# EAGLE design proto (EAGLE 9.2.0)
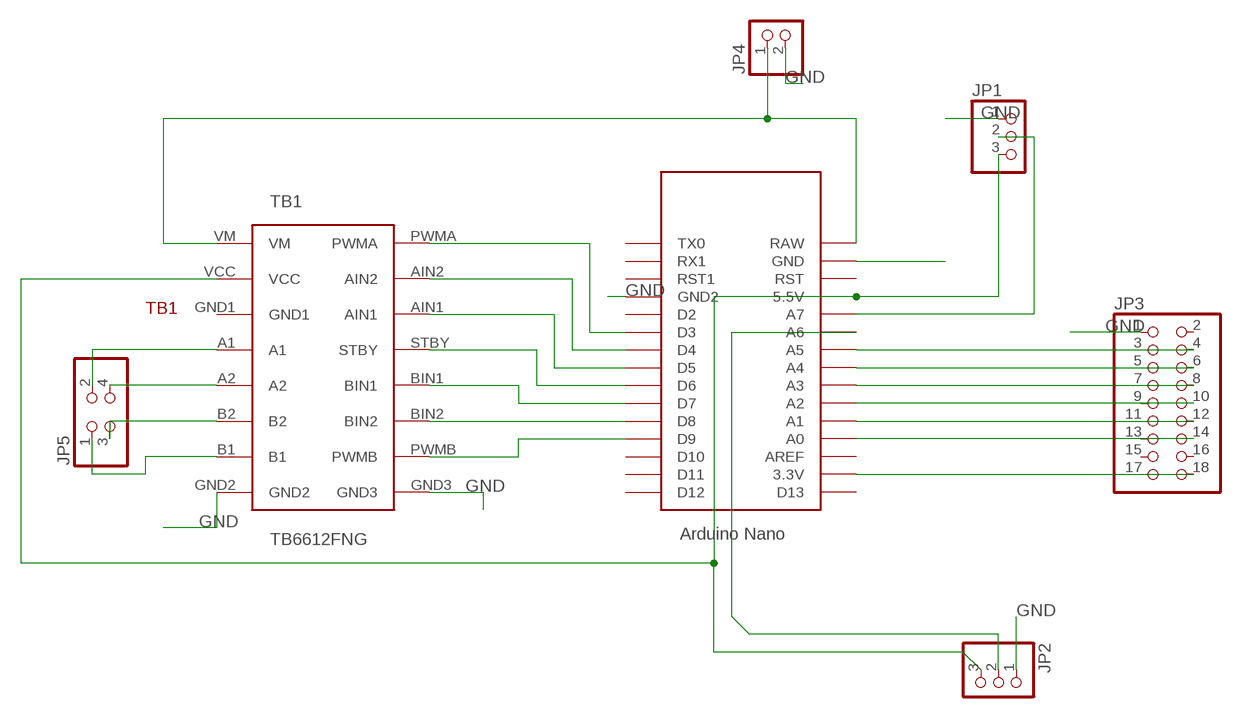
[diagram p0: schematic, sheet 1]

## Parts
JP1  PINHD-1X3  [1X03]
JP2  PINHD-1X3  [1X03]
JP3  PINHD-2X9  [2X09]
JP4  PINHD-1X2  [1X02]
JP5  PINHD-2X2  [2X02]
TB1  TB6612FNG  [TB6612FNG]
U$1  NANO  [NANO]

## Nets
GND: JP1.1 JP2.1 JP3.1 JP4.2 TB1.GND2 TB1.GND3 U$1.GND U$1.GND1(GND2)
N$1: TB1.PWMA U$1.D3
N$2: TB1.AIN2 U$1.D4
N$3: TB1.AIN1 U$1.D5
N$4: TB1.STBY U$1.D6
N$5: TB1.BIN1 U$1.D7
N$6: TB1.BIN2 U$1.D8
N$7: TB1.PWMB U$1.D9
N$8: JP5.2 TB1.A1
N$9: JP4.1 TB1.VM U$1.RAW
N$10: JP3.4 U$1.A5
N$11: JP5.4 TB1.A2
N$12: JP5.3 TB1.B2
N$13: JP5.1 TB1.B1
N$14: JP3.6 U$1.A4
N$15: JP3.8 U$1.A3
N$16: JP3.10 U$1.A2
N$17: JP1.2 U$1.A7
N$18: JP3.12 U$1.A1
N$19: JP3.14 U$1.A0
N$20: JP3.18 U$1.3.3V
N$26: JP2.2 U$1.A6
N$27: JP1.3 JP2.3 TB1.VCC U$1.5V(5.5V)
Unconnected: JP3.2 JP3.3 JP3.5 JP3.7 JP3.9 JP3.11 JP3.13 JP3.15 JP3.16 JP3.17 TB1.GND1 U$1.AREF U$1.D2 U$1.D10 U$1.D11 U$1.D12 U$1.D13 U$1.ICSP1 U$1.ICSP2 U$1.ICSP3 U$1.ICSP4 U$1.ICSP5 U$1.ICSP6 U$1.RST U$1.RST1 U$1.RX1 U$1.TX0

## Library data of the parts
JP1 JP2 = pinhead:PINHD-1X3: PIN HEADER
JP3 = pinhead:PINHD-2X9: PIN HEADER
JP4 = pinhead:PINHD-1X2: PIN HEADER
JP5 = pinhead:PINHD-2X2: PIN HEADER
TB1 = TB6612FNG:TB6612FNG
U$1 = Arduino-clone:NANO: Arduino Nano

## Board
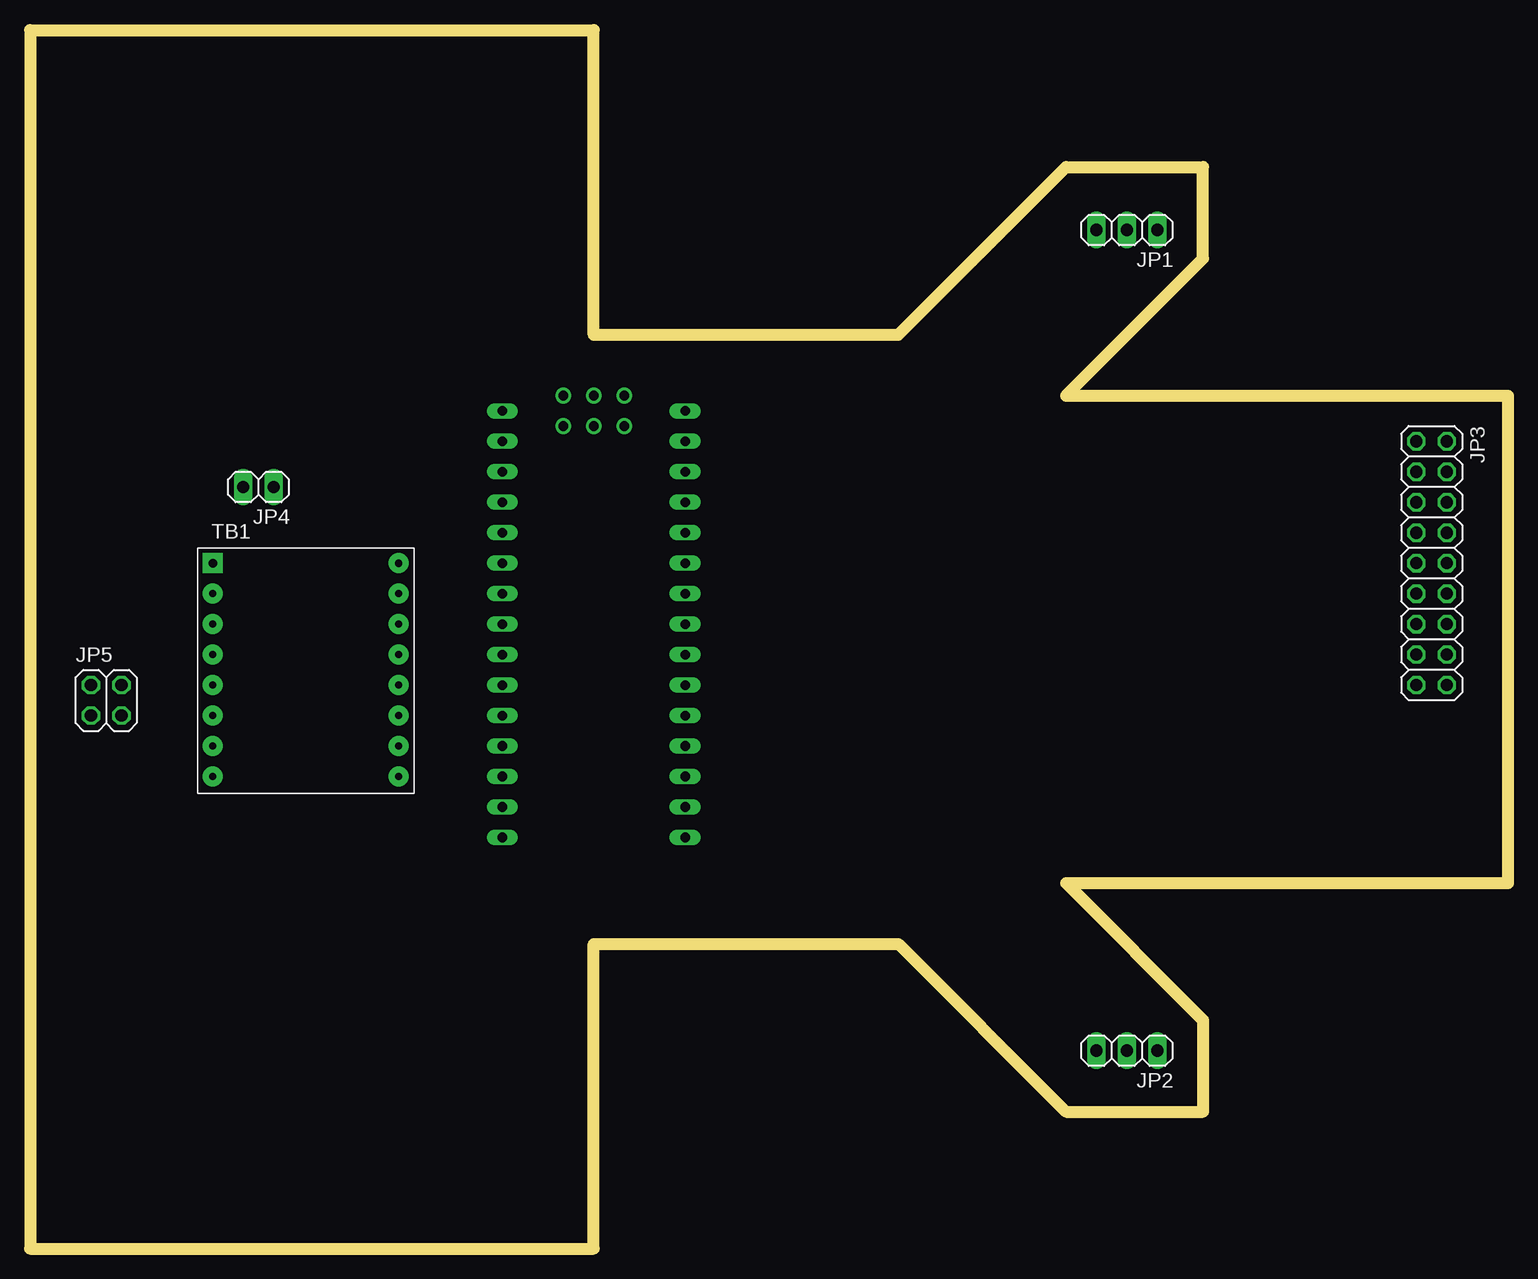
[diagram p1: board, top side]
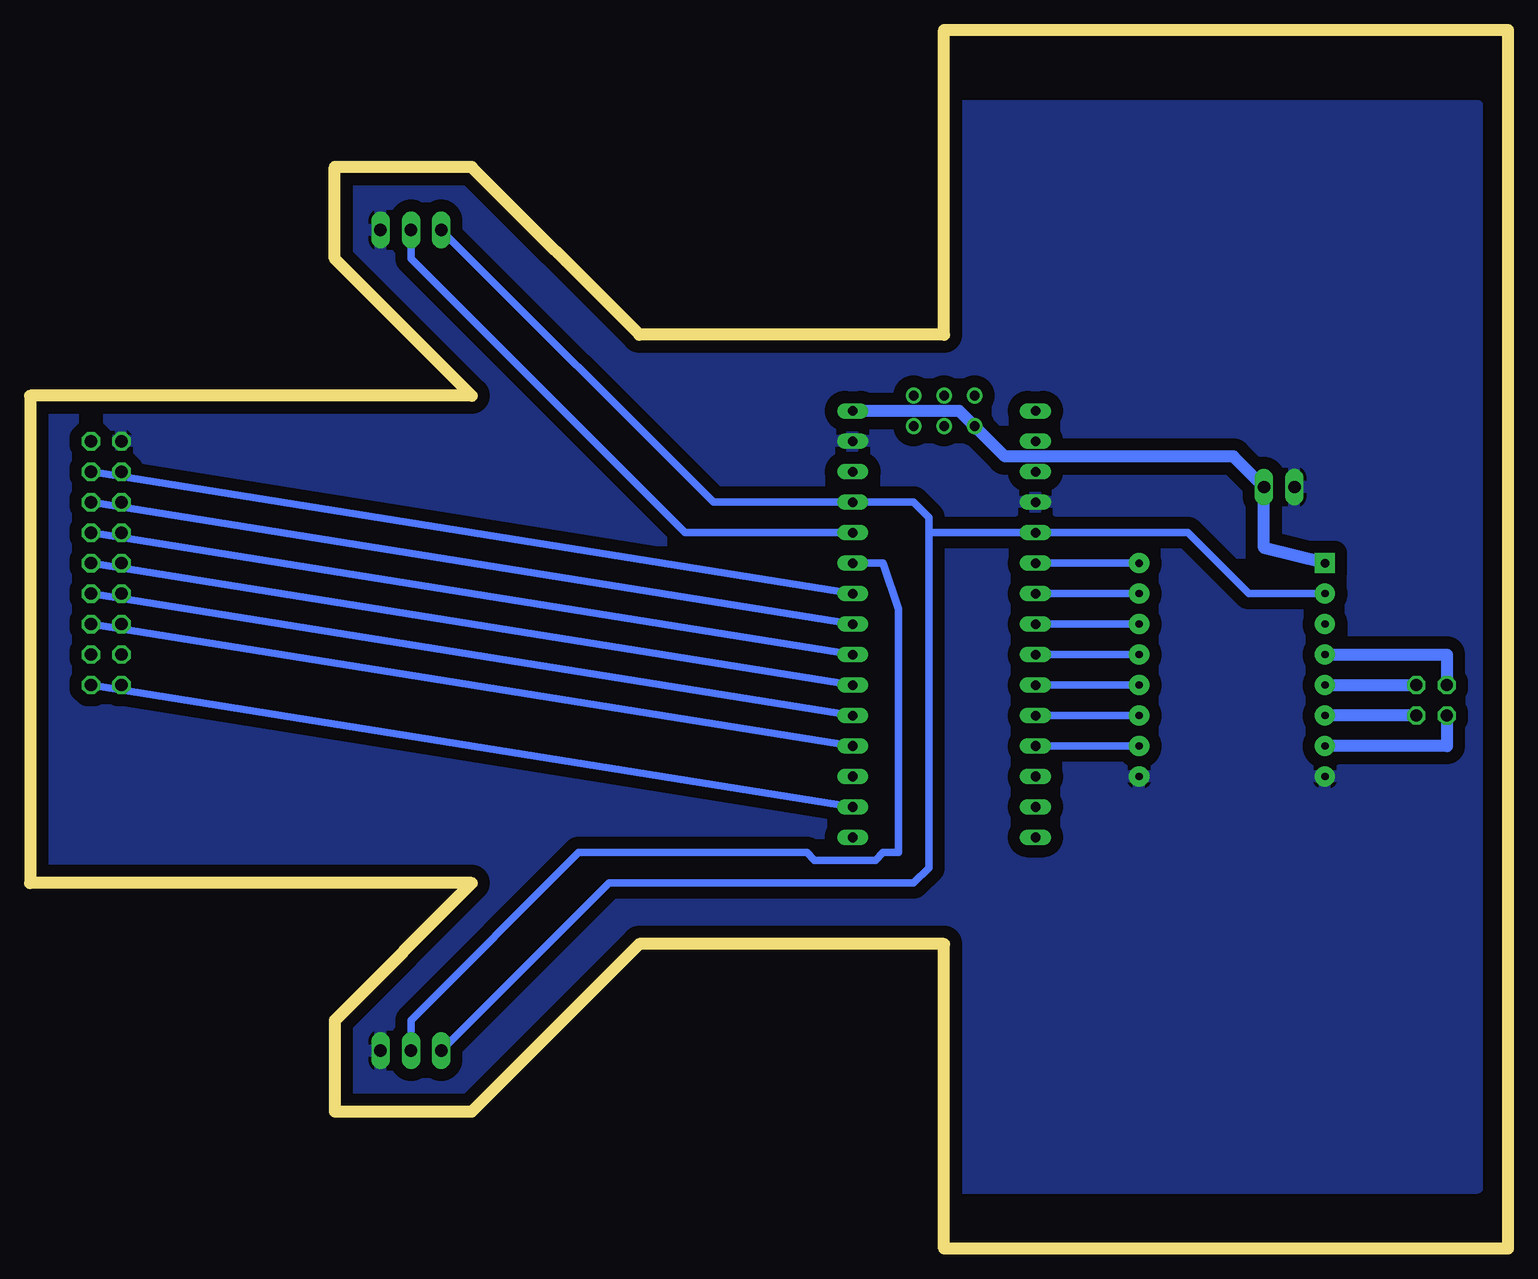
[diagram p2: board, bottom side, seen from below]

Size 123.19 x 101.6 mm. Coordinates in mm from the lower left corner, seen from the top.
Outline: 0,101.6 0,0 46.99,0 46.99,25.4 72.39,25.4 86.36,11.43 97.79,11.43 97.79,19.05 86.36,30.48 123.19,30.48 123.19,71.12 86.36,71.12 97.79,82.55 97.79,90.17 86.36,90.17 72.39,76.2 46.99,76.2 46.99,101.6 0,101.6
Copper layers (1*16): Top 0.035mm / dielectric 1.5mm / Bottom 0.035mm
Design rules "default *": minimum track width 6mil, minimum drill 0.8mm, track to track 6mil, track to pad 6mil, pad to pad 6mil, via to via 6mil, smd to smd 6mil, copper to edge 40mil, drill to drill 6mil, minimum pad ring 10mil, minimum via ring 8mil, stop-mask expansion 4mil, vias tented up to drill 0mil, thermal gap 10mil

### Footprints (pad centres in the part's own frame; a part is rotated, then mirrored left to right if it is on the bottom)
1X03 = drill 1.016 long: 1 -2.54,0; 2 0,0; 3 2.54,0
2X09 = drill 1.016 octagon: 1 -10.16,-1.27; 2 -10.16,1.27; 3 -7.62,-1.27; 4 -7.62,1.27; 5 -5.08,-1.27; 6 -5.08,1.27; 7 -2.54,-1.27; 8 -2.54,1.27; 9 0,-1.27; 10 0,1.27; 11 2.54,-1.27; 12 2.54,1.27; 13 5.08,-1.27; 14 5.08,1.27; 15 7.62,-1.27; 16 7.62,1.27; 17 10.16,-1.27; 18 10.16,1.27
1X02 = drill 1.016 long: 1 -1.27,0; 2 1.27,0
2X02 = drill 1.016 octagon: 1 -1.27,-1.27; 2 -1.27,1.27; 3 1.27,-1.27; 4 1.27,1.27
TB6612FNG = drill 0.6 pad 1.676: A1 -7.62,-1.27; A2 -7.62,-3.81; AIN1 7.874,1.27; AIN2 7.874,3.81; B1 -7.62,-8.89; B2 -7.62,-6.35; BIN1 7.874,-3.81; BIN2 7.874,-6.35; GND1 -7.62,1.27; GND2 -7.62,-11.43; GND3 7.874,-11.43; PWMA 7.874,6.35; PWMB 7.874,-8.89; STBY 7.874,-1.27; VCC -7.62,3.81 | drill 0.7 pad 1.676 square: VM -7.62,6.35
NANO = drill 0.8 long: 3.3V -10.16,24.13; 5V -10.16,-1.27; A0 -10.16,19.05; A1 -10.16,16.51; A2 -10.16,13.97; A3 -10.16,11.43; A4 -10.16,8.89; A5 -10.16,6.35; A6 -10.16,3.81; A7 -10.16,1.27; AREF -10.16,21.59; D2 5.08,1.27; D3 5.08,3.81; D4 5.08,6.35; D5 5.08,8.89; D6 5.08,11.43; D7 5.08,13.97; D8 5.08,16.51; D9 5.08,19.05; D10 5.08,21.59; D11 5.08,24.13; D12 5.08,26.67; D13 -10.16,26.67; GND -10.16,-6.35; GND1 5.08,-1.27; RAW -10.16,-8.89; RST -10.16,-3.81; RST1 5.08,-3.81; RX1 5.08,-6.35; TX0 5.08,-8.89 | drill 0.8: ICSP1 -5.08,-10.16; ICSP2 -5.08,-7.62; ICSP3 -2.54,-10.16; ICSP4 -2.54,-7.62; ICSP5 0,-10.16; ICSP6 0,-7.62

### Placement (x,y rotation side)
JP1  91.44,84.93 180 top
JP2  91.44,16.51 180 top
JP3  116.84,57.15 270 top
JP4  19.05,63.5 180 top
JP5  6.35,45.72 0 top
TB1  22.86,50.8 0 top
U$1  44.45,60.96 180 top

### Tracks (layer width: path | path; a pad name or v marks a point on that pad's centre or on a via)
GND
  pour Bottom (isolate 1.016): 2.54,95.25 125.73,95.25 125.73,5.08 2.54,5.08
N$1
  Bottom 0.61: TB1.PWMA U$1.D3
N$2
  Bottom 0.61: U$1.D4 TB1.AIN2
N$3
  Bottom 0.61: TB1.AIN1 U$1.D5
N$4
  Bottom 0.61: TB1.STBY U$1.D6
N$5
  Bottom 0.61: TB1.BIN1 U$1.D7
N$6
  Bottom 0.61: U$1.D8 TB1.BIN2
N$7
  Bottom 0.61: TB1.PWMB U$1.D9
N$8
  Bottom 1.016: TB1.A1 5.08,49.53 JP5.2
N$9
  Bottom 1.016: U$1.RAW 45.72,69.85 41.91,66.04 22.86,66.04 JP4.1 20.32,58.42 TB1.VM
N$10
  Bottom 0.61: JP3.4 U$1.A5
N$11
  Bottom 1.016: TB1.A2 JP5.4
N$12
  Bottom 1.016: JP5.3 TB1.B2
N$13
  Bottom 1.016: JP5.1 5.08,41.91 TB1.B1
N$14
  Bottom 0.61: U$1.A4 JP3.6
N$15
  Bottom 0.61: JP3.8 U$1.A3
N$16
  Bottom 0.61: U$1.A2 JP3.10
N$17
  Bottom 0.61: U$1.A7 68.58,59.69 91.44,82.55 JP1.2
N$18
  Bottom 0.61: JP3.12 U$1.A1
N$19
  Bottom 0.61: JP3.14 U$1.A0
N$20
  Bottom 0.61: U$1.3.3V JP3.18
N$26
  Bottom 0.61: U$1.A6 52.07,57.15 50.8,53.34 50.8,33.02 52.07,33.02 52.71,32.38 57.79,32.38 58.42,33.02 77.47,33.02 91.44,19.05 JP2.2
N$27
  Bottom 0.61: TB1.VCC 21.59,54.61 26.67,59.69 48.26,59.69 | JP1.3 66.2,62.23 U$1.5V 49.53,62.23 48.26,60.96 48.26,59.69 | 48.26,59.69 48.26,31.75 49.53,30.48 74.93,30.48 JP2.3